# Altium schematic sheet Thermocouple_Amplifier.SchDoc
size Letter; Organization: Altium Limited; Address1: L3, 12a Rodborough Rd; Address2: Frenchs Forest; Address3: NSW; Address4: Australia 2086
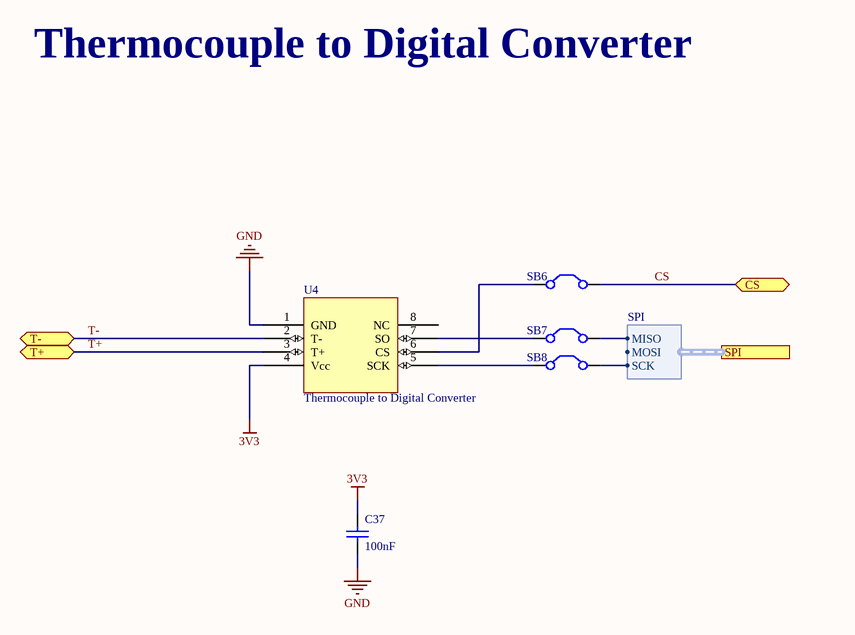
[diagram p0: Thermocouple_Amplifier.SchDoc]

## Parts
C37  value 100nF  [0402]  (hidden comment: Cap)
SB6  Solder Bridge  [SB-2pos]  (value not drawn)
SB7  Solder Bridge  [SB-2pos]  (value not drawn)
SB8  Solder Bridge  [SB-2pos]  (value not drawn)
U4  Thermocouple to Digital Converter  [8-SOIC MAXIM]

## Ports
CS (bidir), SPI (harness SPI), T+ (bidir), T- (bidir)

## Harnesses
SPI: MISO, MOSI, SCK

## Nets
3V3: C37.2 U4.4(Vcc)
GND: C37.1 U4.1(GND)
CS: SB6.2(C2) ; port CS
T+: U4.3(T+) ; port T+
T-: U4.2(T-) ; port T-
NetSB6_1: SB6.1(C1) U4.6(CS)
NetSB7_1: SB7.1(C1) U4.7(SO)
NetSB7_2: SB7.2(C2) ; port SPI.MISO
NetSB8_1: SB8.1(C1) U4.5(SCK)
NetSB8_2: SB8.2(C2) ; port SPI.SCK

Not connected (* = marked no-connect by the designer): U4 8(NC)

## Notes on the sheet
- Thermocouple to Digital Converter
- Title
- Size:
- Date:
- Letter
- Number:
- Time:
- Revision:
- Sheet
- of
- File:

## Library data of the parts
C37 = Cap: Capacitor
SB6-SB8 = Jumper: Jumper Wire
U4 = MAX31855x: Manufacturer PN: MAX31855EASA+; Thermocouple Type: E; DigiKey PN: MAX31855EASA+-ND